# Altium schematic sheet Communication.SchDoc
size A4
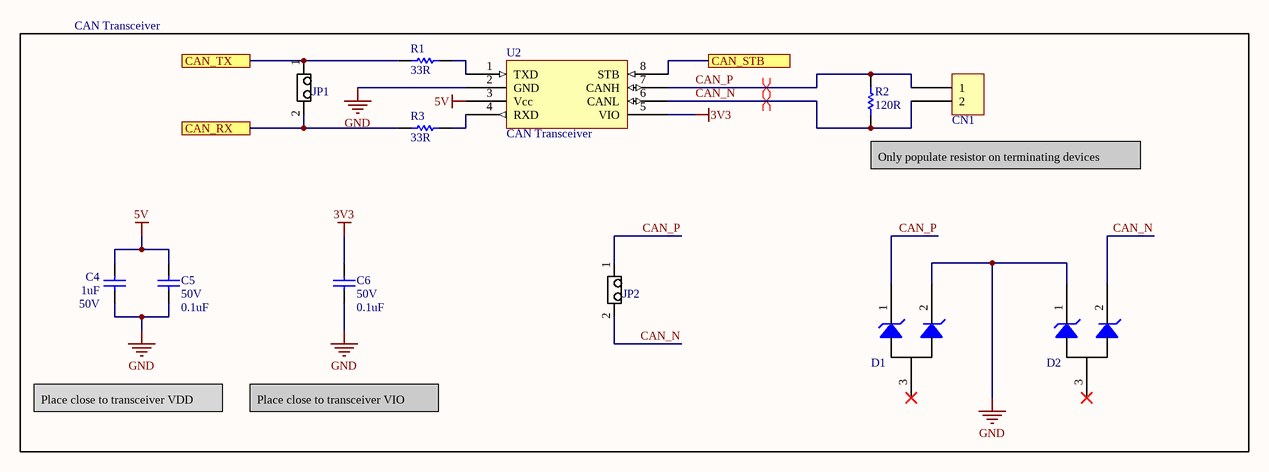
[diagram p0: Communication.SchDoc]

## Parts
C4  Capacitance: 1uF  Voltage: 50V  [0803 CAP]  (hidden comment: CL21B105KBFNNNG)
C5  Voltage: 50V  Capacitance: 0.1uF  [FP-CL10-0_1-IPC_A]  (hidden comment: CL10B104JB8NNNC)
C6  Voltage: 50V  Capacitance: 0.1uF  [FP-CL10-0_1-IPC_A]  (hidden comment: CL10B104JB8NNNC)
CN1  1x2 Shrouded Right Angle  [2X1 Female Header]  (value not drawn)
D1  PESD36VS2UT,215  [SOT95P245X110-3N]  (value not drawn)
D2  PESD36VS2UT,215  [SOT95P245X110-3N]  (value not drawn)
JP1  1x2 Male Header  [2X1 Males Header]  (value not drawn)
JP2  1x2 Male Header  [2X1 Males Header]  (value not drawn)
R1  Resistance: 33R  [RESC1608X55X25LL10T15]  (hidden comment: RC0603FR-0733RL)
R2  Resistance: 120R  [RESC1608X55X25LL10T15]  (hidden comment: RC0603FR-07120RL)
R3  Resistance: 33R  [RESC1608X55X25LL10T15]  (hidden comment: RC0603FR-0733RL)
U2  CAN Transceiver  [8-SOIC]

## Blocks framed on the sheet
CAN Transceiver: C4-C6 CN1 D1 D2 JP1 JP2 R1-R3 U2

## Ports
CAN_RX, CAN_STB, CAN_TX

## Nets
3V3: C6.2 U2.5(VIO)
5V: C4.2 C5.2 U2.3(Vcc)
GND: C4.1 C5.1 C6.1 D1.2(Cathode_2) D2.1(Cathode_1) U2.2(GND)
CAN_N: CN1.2 D2.2(Cathode_2) JP2.2 R2.1 U2.6(CANL)
CAN_P: CN1.1 D1.1(Cathode_1) JP2.1 R2.2 U2.7(CANH)
CAN_RX: JP1.2 R3.1 ; port CAN_RX
CAN_STB: U2.8(STB) ; port CAN_STB
CAN_TX: JP1.1 R1.1 ; port CAN_TX
NetR1_2: R1.2 U2.1(TXD)
NetR3_2: R3.2 U2.4(RXD)

Not connected (* = marked no-connect by the designer): D1 3(Common_Anode); D2 3(Common_Anode)

## Layout directives
differential pair: CAN_N, CAN_P

## Notes on the sheet
- Only populate resistor on terminating devices
- Place close to transceiver VDD
- Place close to transceiver VIO

## Library data of the parts
C4 = CMP-00005-3: SAMSUNG ELECTRO-MECHANICS - CL21B105KBFNNNG - MLCC CAPACITORS; Dielectric: X7R; Tolerance: 10%; Material: Ceramic; Min Operating Temperature: -55°C; Length: 2mm; Termination: Wraparound; Contact Plating: Tin; Package Quantity: 3000; Mount: Surface Mount; Max Operating Temperature: 125°C; Case Code (Imperial): 0805; Thickness: 0.053inch; Case/Package: 0805; Width: 0.049inch; Voltage Rating: 50V; Depth: 1.25mm; Packaging: Tape and Reel; Case Code (Metric): 2012
C5 C6 = CMP-00000-4: CAP CER 0.1UF 50V X7R 0603; Tolerance: 5%; Material: Ceramic; Case Code (Imperial): 0603; Mount: Surface Mount; Thickness: 0.035inch; Depth: 0.8mm; Packaging: Tape and Reel; Package Quantity: 1; Dielectric: X7R; Height: 0.8mm; Radiation Hardening: No; Max Operating Temperature: 125°C; Voltage Rating: 50V; Case/Package: 0603; Min Operating Temperature: -55°C; Case Code (Metric): 1608; Length: 1.6mm; Contact Plating: Tin; Width: 0.031inch
CN1 = CMP-00010-3: 02 MTE HDR SRRA LATCH; Connector Type: Plug,Header,Pin; Backwall/Post Interruptions: No (Without); Pitch: 2.54mm; Approvals: CSA; Gender: Male; Contact Resistance: 15mR; PCB Thickness: 0.062inch; Contact Current Rating: 3A; Contact Retention: Yes (With); Number of Contacts: 2; PCB Mount Retention: Without; Insulation Resistance: 5GR; Row Spacing: 0.1inch; Tail Length: 3.3mm; Contact Plating: Gold,Tin,Matte; ELV: Compliant; Height: 13.59mm; Package Quantity: 68; Current Rating: 3A; Mount: Through Hole; Number of Rows: 1; Contact Material: Brass; Max Operating Temperature: 105°C; Lead Free: Lead Free; Mating Alignment: Yes (With); Min Operating Temperature: -65°C; Flammability Rating: UL94 V-0; Mating Retention: Yes (With); Color: Black; Number of Positions: 2; REACH SVHC: Unknown; Contact Mating Length: 0.23inch; Orientation: Right Angle; Packaging: Rail/Tube; Termination: Crimp; PCB Mount Alignment: No (Without); Contact Shape: Square; PCB Mounting Orientation: Right Angle; Housing Color: Black; Depth: 13.59mm; Length: 7.62mm; Contact Gender: Male; Strain Relief: No (Without); Housing Material: Thermoplastic
D1 D2 = CMP-058-0000-2: TVS DIODE 36V 60V SOT23; Date Created: 2020-05-18; Created By: Miguel Manguerra; Design Item ID: PESD36VS2UT,215; Component Type: Standard; Pin Count: 3; Source: AUVic_Schematic_Library_Diodes.SchLib
JP1 JP2 = CMP-004-0001-1: Made By: Andy Bates; Source: AUVic_Schematic_Library_Connectors.SchLib; Pin Count: 2; Design Item ID: 1x2 Male Header; Component Type: Standard
R1 R3 = CMP-00060-1: Res Thick Film 0603 33 Ohm 1% 1/10W +/-100ppm/ßC Molded SMD Paper T/R; Max Power Dissipation: 100mW; Voltage Rating: 75V; Voltage Rating (DC): 50V; Temperature Coefficient: 100ppm/°C; Depth: 0.8mm; Military Standard: Not; Min Operating Temperature: -55°C; Termination: SMD/SMT; Weight: 7.1E-05oz; Number of Terminations: 2; Height: 0.45mm; Power Rating: 100mW; Composition: Thick Film; Length: 1.6mm; Packaging: Tape and Reel; Lead Pitch: 0.3mm; Lead Free: Lead Free; Max Operating Temperature: 155°C; REACH SVHC: No SVHC; Features: Moisture Resistant; Tolerance: 1%; Case/Package: 0603; Package Quantity: 1; Width: 0.8mm; Case Code (Metric): 1608; Number of Pins: 2; Case Code (Imperial): 0603
R2 = CMP-00061-1: Res Thick Film 0603 120 Ohm 1% 0.1W(1/10W) ±100ppm/C Epoxy SMD T/R; Power Rating: 100mW; Voltage Rating (DC): 50V; Temperature Coefficient: 100ppm/°C; Depth: 0.8mm; Max Operating Temperature: 155°C; Case/Package: 0603; Lead Free: Lead Free; Height: 0.022inch; Length: 1.6mm; Case Code (Metric): 1608; Package Quantity: 1; Features: Moisture Resistant; Termination: SMD/SMT; Military Standard: Not; Number of Pins: 2; Width: 0.031inch; REACH SVHC: No SVHC; Max Power Dissipation: 100mW; Min Operating Temperature: -55°C; Packaging: Tape and Reel; Composition: Thick Film; Tolerance: 1%; Voltage Rating: 50V; Number of Terminations: 2; Case Code (Imperial): 0603
U2 = CMP-032-0000-2: 1/1 Transceiver Half CANbus 8-SO; Data Rate: 1Mbps; Max Supply Voltage: 5.5V; Propagation Delay: 250ns; Number of Transceivers: 1; Nominal Supply Current: 70mA; Min Supply Voltage: 4.5V; Min Operating Temperature: -40°C; Radiation Hardening: No; Packaging: Tape and Reel; Turn-On Delay Time: 250ns; Case/Package: SO; Contact Plating: Gold; Package Quantity: 2500; Number of Pins: 8; Max Supply Current: 70mA; Max Operating Temperature: 150°C; Interface: CAN; Mount: Surface Mount; Lead Free: Lead Free